# Altium schematic sheet Sheet2.SchDoc
size A3
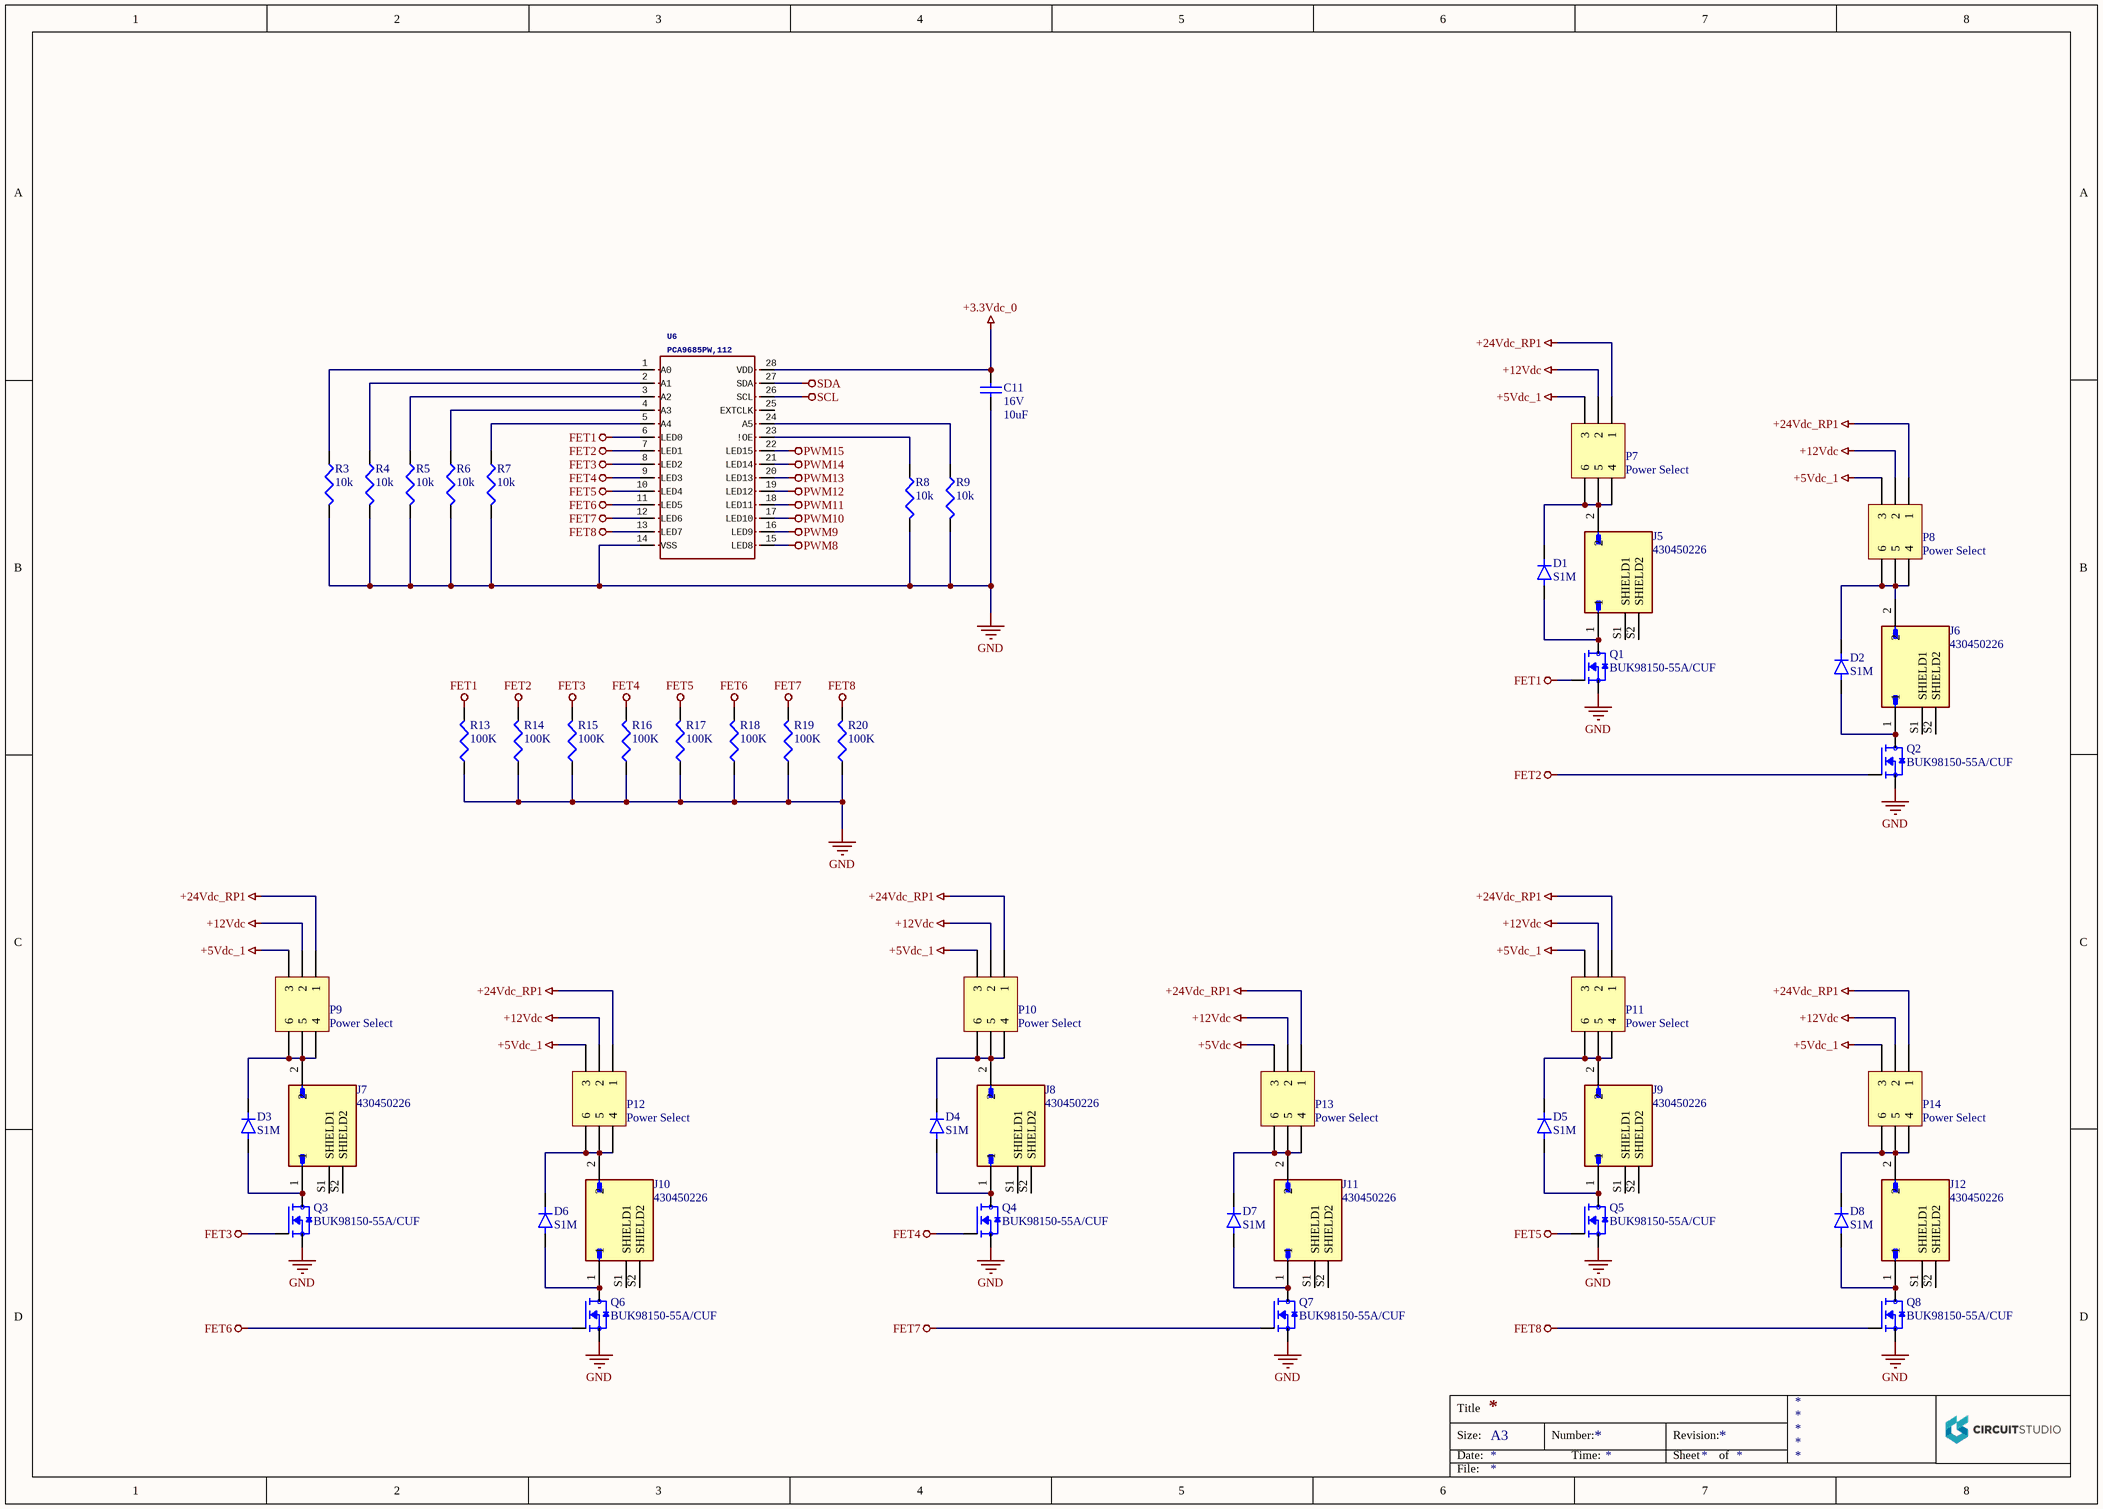
[diagram p0: Sheet2.SchDoc]

## Parts
C11  16V  value 10uF  [1608[0603]]
D1  S1M  [DIOM4325X250N]
D2  S1M  [DIOM4325X250N]
D3  S1M  [DIOM4325X250N]
D4  S1M  [DIOM4325X250N]
D5  S1M  [DIOM4325X250N]
D6  S1M  [DIOM4325X250N]
D7  S1M  [DIOM4325X250N]
D8  S1M  [DIOM4325X250N]
J5  430450226  [MOLEX_430450226]
J6  430450226  [MOLEX_430450226]
J7  430450226  [MOLEX_430450226]
J8  430450226  [MOLEX_430450226]
J9  430450226  [MOLEX_430450226]
J10  430450226  [MOLEX_430450226]
J11  430450226  [MOLEX_430450226]
J12  430450226  [MOLEX_430450226]
P7  Power Select  [HDR2X3_CEN]
P8  Power Select  [HDR2X3_CEN]
P9  Power Select  [HDR2X3_CEN]
P10  Power Select  [HDR2X3_CEN]
P11  Power Select  [HDR2X3_CEN]
P12  Power Select  [HDR2X3_CEN]
P13  Power Select  [HDR2X3_CEN]
P14  Power Select  [HDR2X3_CEN]
Q1  BUK98150-55A/CUF  [SOT230P700X180-4N]
Q2  BUK98150-55A/CUF  [SOT230P700X180-4N]
Q3  BUK98150-55A/CUF  [SOT230P700X180-4N]
Q4  BUK98150-55A/CUF  [SOT230P700X180-4N]
Q5  BUK98150-55A/CUF  [SOT230P700X180-4N]
Q6  BUK98150-55A/CUF  [SOT230P700X180-4N]
Q7  BUK98150-55A/CUF  [SOT230P700X180-4N]
Q8  BUK98150-55A/CUF  [SOT230P700X180-4N]
R3  value 10k  [0402]  (hidden comment: Res3)
R4  value 10k  [0402]  (hidden comment: Res3)
R5  value 10k  [0402]  (hidden comment: Res3)
R6  value 10k  [0402]  (hidden comment: Res3)
R7  value 10k  [0402]  (hidden comment: Res3)
R8  value 10k  [0402]  (hidden comment: Res3)
R9  value 10k  [0402]  (hidden comment: Res3)
R13  value 100K  [J1-0603]  (hidden comment: Res3)
R14  value 100K  [J1-0603]  (hidden comment: Res3)
R15  value 100K  [J1-0603]  (hidden comment: Res3)
R16  value 100K  [J1-0603]  (hidden comment: Res3)
R17  value 100K  [J1-0603]  (hidden comment: Res3)
R18  value 100K  [J1-0603]  (hidden comment: Res3)
R19  value 100K  [J1-0603]  (hidden comment: Res3)
R20  value 100K  [J1-0603]  (hidden comment: Res3)
U6  PCA9685PW,112  [TSSOP28-0.65-9.7X4.4MM]

## Nets
+3.3Vdc_0: C11.1 U6.28(VDD)
+5Vdc: P13.3
+5Vdc_1: P7.3 P8.3 P9.3 P10.3 P11.3 P12.3 P14.3
+12Vdc: P7.2 P8.2 P9.2 P10.2 P11.2 P12.2 P13.2 P14.2
+24Vdc_RP1: P7.1 P8.1 P9.1 P10.1 P11.1 P12.1 P13.1 P14.1
FET1: Q1.1(G) R13.2 U6.6(LED0)
FET2: Q2.1(G) R14.2 U6.7(LED1)
FET3: Q3.1(G) R15.2 U6.8(LED2)
FET4: Q4.1(G) R16.2 U6.9(LED3)
FET5: Q5.1(G) R17.2 U6.10(LED4)
FET6: Q6.1(G) R18.2 U6.11(LED5)
FET7: Q7.1(G) R19.2 U6.12(LED6)
FET8: Q8.1(G) R20.2 U6.13(LED7)
GND: C11.2 Q1.3(S) Q2.3(S) Q3.3(S) Q4.3(S) Q5.3(S) Q6.3(S) Q7.3(S) Q8.3(S) R3.2 R4.2 R5.2 R6.2 R7.2 R8.2 R9.2 R13.1 R14.1 R15.1 R16.1 R17.1 R18.1 R19.1 R20.1 U6.14(VSS)
PWM8: U6.15(LED8)
PWM9: U6.16(LED9)
PWM10: U6.17(LED10)
PWM11: U6.18(LED11)
PWM12: U6.19(LED12)
PWM13: U6.20(LED13)
PWM14: U6.21(LED14)
PWM15: U6.22(LED15)
SCL: U6.26(SCL)
SDA: U6.27(SDA)
NetD1_A: D1.A J5.1 Q1.2(D) Q1.4(D)
NetD1_C: D1.C(K) J5.2 P7.4 P7.5 P7.6
NetD2_A: D2.A J6.1 Q2.2(D) Q2.4(D)
NetD2_C: D2.C(K) J6.2 P8.4 P8.5 P8.6
NetD3_A: D3.A J7.1 Q3.2(D) Q3.4(D)
NetD3_C: D3.C(K) J7.2 P9.4 P9.5 P9.6
NetD4_A: D4.A J8.1 Q4.2(D) Q4.4(D)
NetD4_C: D4.C(K) J8.2 P10.4 P10.5 P10.6
NetD5_A: D5.A J9.1 Q5.2(D) Q5.4(D)
NetD5_C: D5.C(K) J9.2 P11.4 P11.5 P11.6
NetD6_A: D6.A J10.1 Q6.2(D) Q6.4(D)
NetD6_C: D6.C(K) J10.2 P12.4 P12.5 P12.6
NetD7_A: D7.A J11.1 Q7.2(D) Q7.4(D)
NetD7_C: D7.C(K) J11.2 P13.4 P13.5 P13.6
NetD8_A: D8.A J12.1 Q8.2(D) Q8.4(D)
NetD8_C: D8.C(K) J12.2 P14.4 P14.5 P14.6
NetR3_1: R3.1 U6.1(A0)
NetR4_1: R4.1 U6.2(A1)
NetR5_1: R5.1 U6.3(A2)
NetR6_1: R6.1 U6.4(A3)
NetR7_1: R7.1 U6.5(A4)
NetR8_1: R8.1 U6.23(!OE)
NetR9_1: R9.1 U6.24(A5)

Not connected (* = marked no-connect by the designer): J5 S1(SHIELD1) S2(SHIELD2); J6 S1(SHIELD1) S2(SHIELD2); J7 S1(SHIELD1) S2(SHIELD2); J8 S1(SHIELD1) S2(SHIELD2); J9 S1(SHIELD1) S2(SHIELD2); J10 S1(SHIELD1) S2(SHIELD2); J11 S1(SHIELD1) S2(SHIELD2); J12 S1(SHIELD1) S2(SHIELD2); U6 25(EXTCLK)

## Notes on the sheet
- Title
- Size:
- Date:
- A3
- Number:
- Time:
- Revision:
- Sheet
- of
- File:

## Library data of the parts
C11 = Cap Semi: CAP CER 10UF 16V X5R 0603; Manufacturer Part #: CC0603KRX5R7BB106; Manufacturer: YAGEO; Footprints: 0603
D1-D8 = S1M: DIODE GEN PURP 1KV 1A SMA; Manufacturer Part #: S1MLHRVG; Manufacturer: Taiwan Semiconductor
J5-J12 = 430450226: CONN HEADER VERT 2POS; Manufacturer Part #: 0430450226; Manfacturer: Molex; Do Not Install: *; Vendor: *; Vendor Part Number: *
P7-P14 = Header 3X2A: Header, 3-Pin, Dual row; Manufacturer Part #: 67997-206HLF; Manufacturer: Amphenol ICC (FCI)
Q1-Q8 = BUK98150-55A/CUF: N-MOSFET N-CH 55V 5.5A SOT223; Manufacturer: Nexperia USA; Manufacturer Part #: BUK98150-55A/CUF; Footprint: SOT223
R3-R9 = Res3: RES 10 KOHM 1% 1/8W 0402; Manufacturer Part #: AC0402FR-7W10KL; Manufacturer: YAGEO; Footprints: 0402
R13-R20 = Res3: RES 100K OHM 1% 1/4W 0603; Manufacturer Part #: SR0603FR-7T100KL; Manufacturer: YAGEO; Footprints: 0603
U6 = DRIVER-PCA9685PW(TSSOP28): Manufacturer: NXP USA; Manufacturer Part #: PCA9685PW,112